# Altium schematic sheet 1_P1.schdoc
size 307 x 218 mm; Symbol: Drawing-Symbol_A4; Device: Drawing-Symbol_A4; Company: 嘉立创EDA; Version: V1.0; Page Size: A4; @Project Name: Analog_Buck; @Page Count: 1; @Update Date: 2025-11-11; @Create Date: 2025-11-09; @Schematic Name: Schematic1; @Page No: 1; @Page Name: P1; @Create Time: 08:32:45; @Update Time: 21:01:50; Width: 1170; Height: 825; Region Start: 1; X Region Count: 6; Y Region Count: 4; Blade Width: 10; Title Block Position: 3; @Board Name: Board1
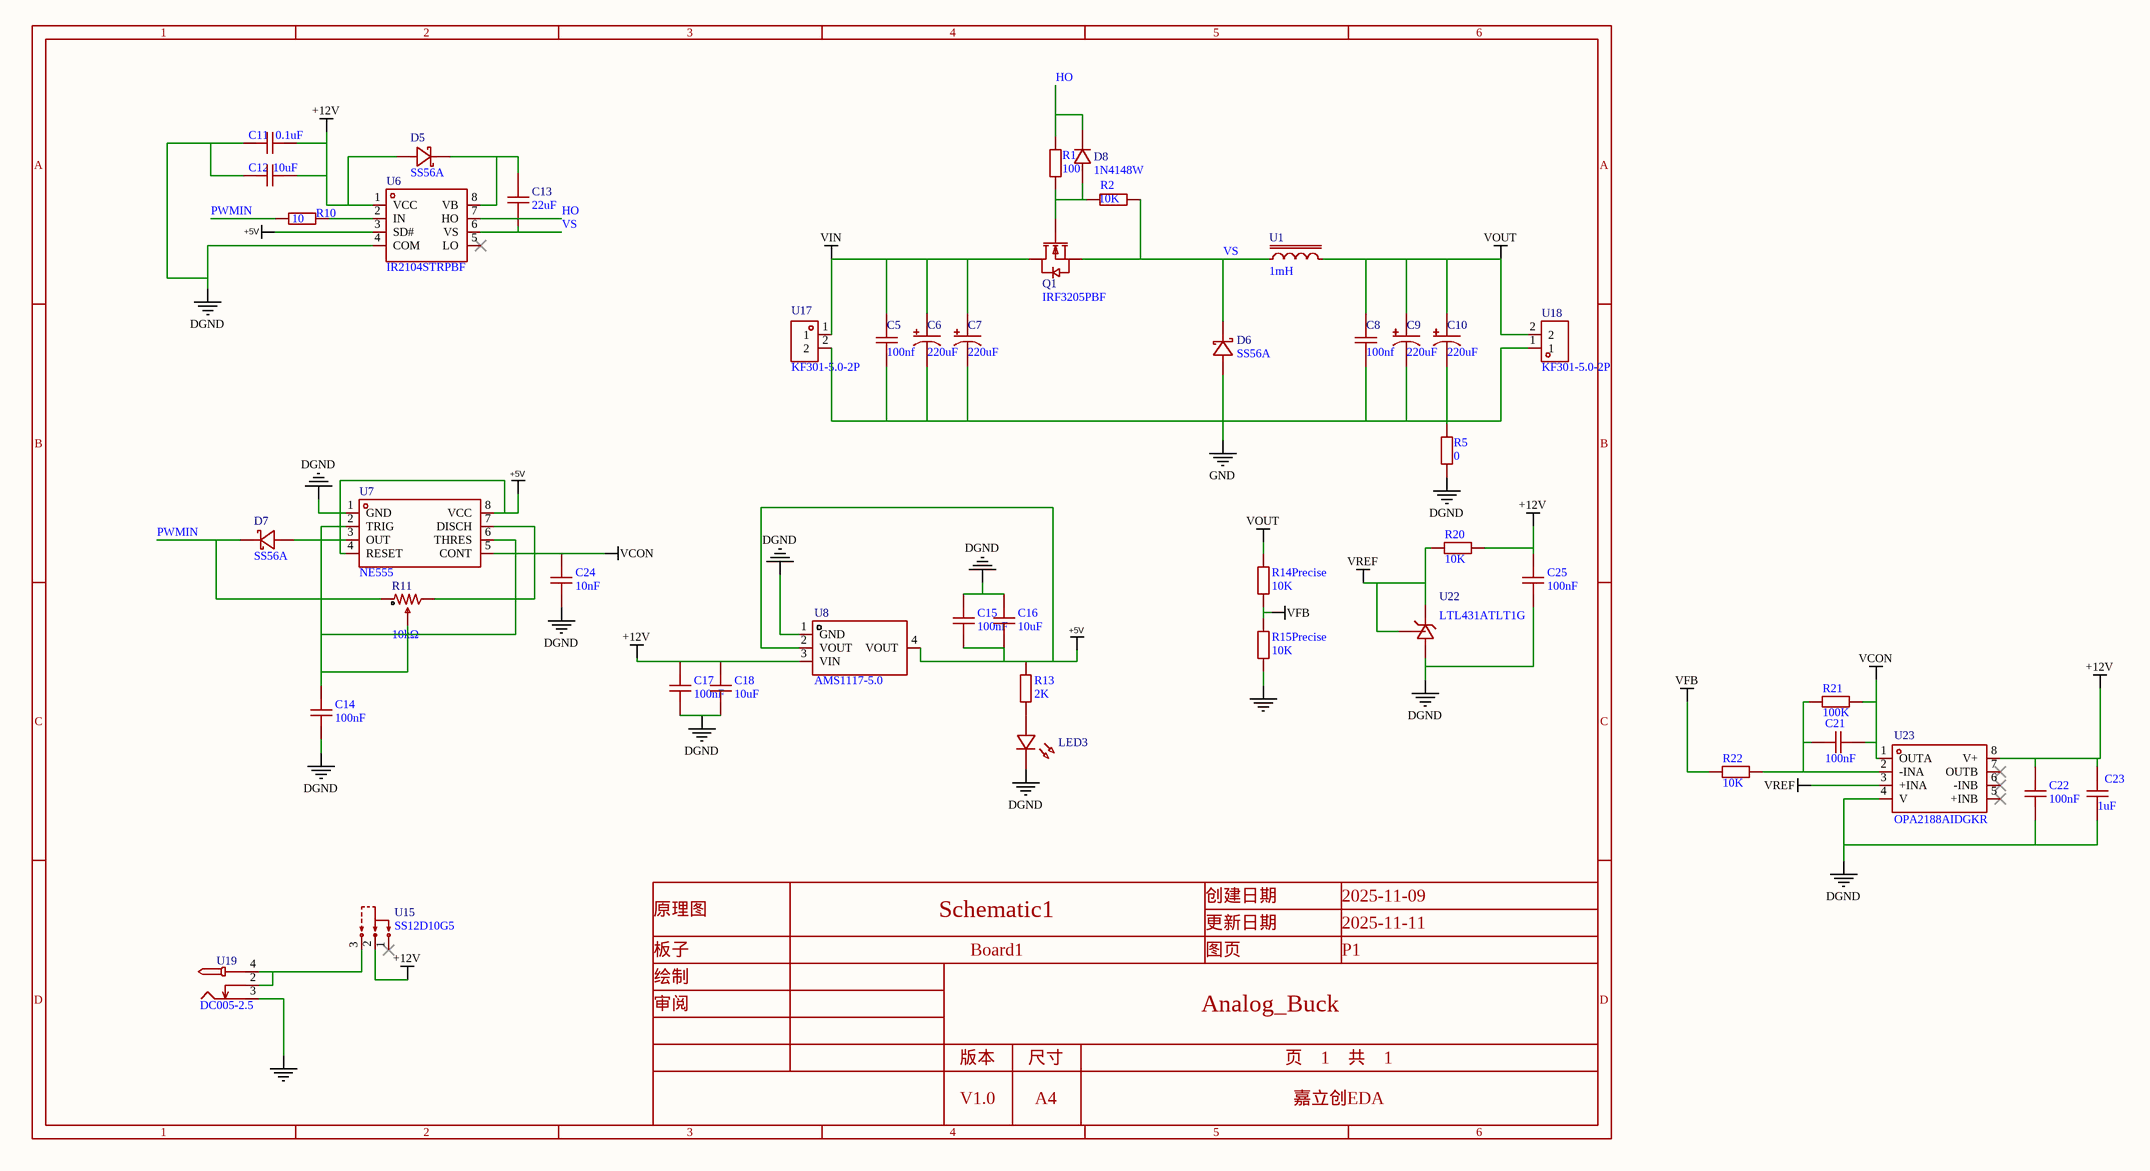
[diagram p0: 1_P1.schdoc]

## Parts
C5  100nf  [CAP-TH_L8.5-W5.0-P5.00-D1.2]
C6  220uF  [CAP-TH_BD10.0-P5.00-D0.6-FD]
C7  220uF  [CAP-TH_BD10.0-P5.00-D0.6-FD]
C8  100nf  [CAP-TH_L8.5-W5.0-P5.00-D1.2]
C9  220uF  [CAP-TH_BD10.0-P5.00-D0.6-FD]
C10  220uF  [CAP-TH_BD10.0-P5.00-D0.6-FD]
C11  0.1uF  [C0603]
C12  10uF  [C0603]
C13  22uF  [CAP-TH_L6.0-W3.8-P5.08-D0.6]
C14  100nF  [C0603]
C15  100nF  [C0603]
C16  10uF  [C0603]
C17  100nF  [C0603]
C18  10uF  [C0603]
C21  100nF  [C0603]
C22  100nF  [C0603]
C23  1uF  [C0603]
C24  10nF  [C0603]
C25  100nF  [C0603]
D5  SS56A  [SMA_L4.2-W2.6-LS5.0-RD]
D6  SS56A  [SMA_L4.2-W2.6-LS5.0-RD]
D7  SS56A  [SMA_L4.2-W2.6-LS5.0-RD]
D8  1N4148W  [SOD-123F_L2.7-W1.6-LS3.8-RD]
LED3  (no value)  [LED_0805]
Q1  IRF3205PBF  [TO-220-3_L10.0-W4.5-P2.54-L]
R1  100  [R0603]
R2  10K  [R0603]
R5  0  [R0603]
R10  10  [R0603]
R11  10kΩ  [RES-ADJ-TH_3P-L9.5-W4.9-P2.50-L_3296W]
R13  2K  [R0603]
R14Precise  10K  [R0603]
R15Precise  10K  [R0603]
R20  10K  [R0603]
R21  100K  [R0603]
R22  10K  [R0603]
U1  1mH  [IND-TH_L33.0-W15.6-P15.00-D1.5]
U6  IR2104STRPBF  [SOIC-8_L4.9-W3.9-P1.27-LS6.0-BL]
U7  NE555  [SOP-8_L5.0-W4.0-P1.27-LS6.0-BL]
U8  AMS1117-5.0  [SOT-223_L6.5-W3.5-P2.30-LS7.0-BR]
U15  SS12D10G5  [SW-TH_SHOU-HAN_SS12D10G4]
U17  KF301-5.0-2P  [CONN-TH_P5.00_KF301-5.0-2P]
U18  KF301-5.0-2P  [CONN-TH_P5.00_KF301-5.0-2P]
U19  DC005-2.5  [DC-IN-TH_DC005-2.5MM]
U22  LTL431ATLT1G  [SOT-23-3_L2.9-W1.3-P1.90-LS2.4-BR]
U23  OPA2188AIDGKR  [VSSOP-8_L3.0-W3.0-P0.65-LS4.9-BL]

## Nets
+5V: C15.1 C16.1 R13.2 U6.3(SD#) U7.4(RESET) U7.8(VCC) U8.2(VOUT) U8.4(VOUT)
+12V: C11.1 C12.1 C17.2 C18.2 C22.2 C23.2 C25.2 D5.2(A) R20.2 U6.1(VCC) U8.3(VIN) U15.2 U23.8(V+)
DGND: C11.2 C12.2 C14.1 C15.2 C16.2 C17.1 C18.1 C22.1 C23.1 C24.1 C25.1 LED3.1(C) R5.1 U6.4(COM) U7.1(GND) U8.1(GND) U19.3 U22.3(A) U23.4(V)
GND: C5.1 C6.2 C7.2 C8.1 C9.2 C10.2 D6.2(A) R5.2 R15Precise.1 U17.2 U18.1
VCON: C21.2 C24.2 R21.1 U7.5(CONT) U23.1(OUTA)
VFB: R14Precise.1 R15Precise.2 R22.1
VIN: C5.2 C6.1 C7.1 Q1.2(D) U17.1
VOUT: C8.2 C9.1 C10.1 R14Precise.2 U1.2 U18.2
VREF: R20.1 U22.1(C) U22.2(REF) U23.3(+INA)
HO: D8.1(K) R1.1 U6.7(HO)
PWMIN: D7.1(K) R10.1 R11.1
VS: C13.1 D6.1(K) Q1.3(S) R2.1 U1.1 U6.6(VS)
NetC13_2: C13.2 D5.1(K) U6.8(VB)
NetC14_2: C14.2 R11.2 U7.2(TRIG) U7.6(THRES)
NetC21_1: C21.1 R21.2 R22.2 U23.2(-INA)
NetD7_2: D7.2(A) U7.3(OUT)
NetD8_2: D8.2(A) Q1.1(G) R1.2 R2.2
NetLED3_2: LED3.2(A) R13.1
NetR10_2: R10.2 U6.2(IN)
NetR11_3: R11.3 U7.7(DISCH)
NetU15_3: U15.3 U19.2 U19.4

Not connected (* = marked no-connect by the designer): U6 5(LO)*; U15 1*; U23 5(+INB)* 6(-INB)* 7(OUTB)*

## Notes on the sheet
- 1
- 2
- 3
- 4
- 5
- 6
- A
- B
- C
- 原理图
- Schematic1
- 创建日期
- 更新日期
- 2025-11-09
- 2025-11-11
- 板子
- 绘制
- Board1
- 图页
- P1
- D
- 审阅
- 版本
- 尺寸
- Analog_Buck
- 页    1    共    1
- V1.0
- A4
- 嘉立创EDA

## Library data of the parts
C5 C8 = CT4-0805B104K500F3: Manufacturer: FH(风华); Add into BOM: yes; Tolerance: ±10%; Voltage Rated: 50V; Temperature Coefficient: X7R; Symbol: CT4-0805B104K500F3; Device: CT4-0805B104K500F3; LCSC Part Name: 100nF ±10% 50V C3型（直脚）; Manufacturer Part: CT4-0805B104K500F3; Supplier Footprint: 插件,P=5.08mm; JLCPCB Part Class: 扩展库; Datasheet: https://atta.szlcsc.com/upload/public/pdf/source/20190402/C385200_059806A6312B28FF1421A2413EB641E1.pdf; Supplier: LCSC; Convert to PCB: yes; Value: 100nf
C6 C7 C9 C10 = ECF1JM221G17OTPO: Manufacturer: Yunxing(云星); Symbol: LKME2502A221MF; Add into BOM: yes; Tolerance: ±20%; Voltage Rating: 63V; Lifetime: 6000hrs@105℃; Device: ECF1JM221G17OTPO; LCSC Part Name: 220uF ±20% 63V; Supplier Part: C783503; Manufacturer Part: ECF1JM221G17OTPO; Supplier Footprint: 插件,D10xL17mm; JLCPCB Part Class: Extended Part; Datasheet: https://item.szlcsc.com/datasheet/ECF1JM221G17OTPO/837828.html; Supplier: LCSC; Convert to PCB: yes; Value: 220uF; Ripple Current: -; Equivalent Series Resistance(ESR): -; Pin Spacing: -; Diameter: 10mm; Height - Seated (Max): 17mm; Operating Temperature: -40℃~+105℃
C11 C12 C14-C18 C21 C24 = CAP_0603: Symbol: Capacitance; Convert to PCB: yes; Device: CAP_0603; Add into BOM: yes; Supplier Footprint: 0603
  C11: Value: 0.1uF
  C12 C16 C18: Value: 10uF
  C14 C15 C17 C21: Value: 100nF
  C24: Value: 10nF
C13 = CD1H225KC9BER1F100: Manufacturer: Dersonic(德尔创); Symbol: CT40805B104K500F3; Add into BOM: yes; Tolerance: ±10%; Voltage Rating: 50V; Temperature Coefficient: X7R; Device: CD1H225KC9BER1F100; LCSC Part Name: 2.2uF ±10% 50V; Manufacturer Part: CD1H225KC9BER1F100; Supplier Footprint: 插件,P=5.08mm; JLCPCB Part Class: Extended Part; Datasheet: https://item.szlcsc.com/datasheet/CD1H225KC9BER1F100/3383616.html; Supplier: LCSC; Convert to PCB: yes; Value: 22uF
C22 C23 C25 = CAP_0603: Symbol: CapAcitance; Convert to PCB: yes; Device: CAP_0603; Add into BOM: yes; Supplier Footprint: 0603
  C22 C25: Value: 100nF
  C23: Value: 1uF
D5-D7 = SS56A: Manufacturer: FUXINSEMI(富芯森美); Add into BOM: yes; Diode Configuration: 独立式; Voltage - Forward(Vf@If): 700mV@5A; Voltage - DC Reverse(Vr): 60V; Current - Rectified: 5A; Reverse Leakage Current (Ir): 500nA; Operating Junction Temperature Range: -55℃~+150℃; Non-Repetitive Peak Forward Surge Current: 150A; Symbol: SS56A; Device: SS56A; LCSC Part Name: 电压:60V 电流:5A; Supplier Part: C842793; Manufacturer Part: SS56A; Supplier Footprint: SMA(DO-214AC); JLCPCB Part Class: 扩展库; Datasheet: https://item.szlcsc.com/datasheet/SS56A/901411.html; Supplier: LCSC; Convert to PCB: yes
D8 = 1N4148W_C81598: Manufacturer: ST(先科); Add into BOM: yes; Diode Configuration: 独立式; Voltage - Forward(Vf@If): 1V@50mA; Voltage - DC Reverse(Vr): 75V; Current - Rectified: 150mA; Pd - Power Dissipation: 400mW; Reverse Leakage Current (Ir): 1uA@75V; Reverse Recovery Time (trr): 4ns; Non-Repetitive Peak Forward Surge Current: 1A; Symbol: 1N4148W_C81598; Device: 1N4148W_C81598; LCSC Part Name: 1N4148W; Supplier Part: C81598; Manufacturer Part: 1N4148W; Supplier Footprint: SOD-123; JLCPCB Part Class: 基础库; Datasheet: https://item.szlcsc.com/datasheet/1N4148W/82750.html; Supplier: LCSC; Convert to PCB: yes; Operating Junction Temperature Range: -
LED3 = LED_0805-G: Symbol: LED_G; Convert to PCB: yes; Device: LED_0805-G; Add into BOM: yes; Supplier Footprint: 0805
Q1 = IRF3205PBF: Manufacturer: Infineon(英飞凌); Add into BOM: yes; Type: 1个N沟道; Drain Source Voltage (Vdss): 55V; Continuous Drain Current (Id): 110A; Drain Source On Resistance (RDS(on)@Vgs,Id): 8mΩ@10V,62A; Power Dissipation (Pd): 200W; Gate Threshold Voltage (Vgs(th)@Id): 4V@250uA; Total Gate Charge (Qg@Vgs): 146nC; Input Capacitance (Ciss@Vds): 3.247nF; Reverse Transfer Capacitance (Crss@Vds): 211pF; Symbol: IRF3205PBF; Device: IRF3205PBF; LCSC Part Name: 1个N沟道 耐压:55V 电流:110A; Supplier Part: C2561; Manufacturer Part: IRF3205PBF; Supplier Footprint: TO-220AB; JLCPCB Part Class: 扩展库; Datasheet: https://atta.szlcsc.com/upload/public/pdf/source/20201126/C2561_C063ADD03C5ACFC796E423BE08ECDD89.pdf; Supplier: LCSC; Convert to PCB: yes; Operating Temperature: -55℃~+175℃
R1 R2 R5 R10 R13 R14Precise R15Precise R20-R22 = Res_0603: Symbol: 电阻; Convert to PCB: yes; Device: Res_0603; Add into BOM: yes; Supplier Footprint: 0603
  R1: Value: 100
  R2 R14Precise R15Precise R20 R22: Value: 10K
  R5: Value: 0
  R10: Value: 10
  R13: Value: 2K
  R21: Value: 100K
R11 = 3296W-1-103LF_C49190453: Manufacturer: JIERR(捷而瑞); Add into BOM: yes; Tolerance: ±10%; Power(Watts): 500mW; Temperature Coefficient: ±250ppm/℃; Number of Turns: 28; Symbol: 3296W-1-103LF_C49190453; Device: 3296W-1-103LF_C49190453; LCSC Part Name: 3296W-1-103LF; Supplier Part: C49190453; Manufacturer Part: 3296W-1-103LF; Supplier Footprint: 插件-3P,9.5x4.9mm; JLCPCB Part Class: 扩展库; Datasheet: https://item.szlcsc.com/datasheet/3296W-1-103LF/51587046.html; Supplier: LCSC; Convert to PCB: yes; Value: 10kΩ
U1 = XR106125TS470MV1L5: Manufacturer: XR(祥如); Add into BOM: yes; Tolerance: ±10%; Rated Current: 12A; Wire Diameter: 1.5mm; Symbol: XR106125TS470MV1L5; Device: XR106125TS470MV1L5; LCSC Part Name: 47uH ±10% 磁环电感; Manufacturer Part: XR106125TS470MV1L5; Supplier Footprint: 插件,33x15.6mm; JLCPCB Part Class: 扩展库; Datasheet: https://atta.szlcsc.com/upload/public/pdf/source/20240313/975BD6823DE6C304357683F4CE864895.pdf; Supplier: LCSC; Convert to PCB: yes; Value: 1mH; Type: 磁环电感
U6 = IR2104STRPBF: Manufacturer: Infineon(英飞凌); Add into BOM: yes; Driven Configuration: 半桥; Load Type: IGBT；MOSFET; Number of Drivers: 2; Current - Output Low(IOL): 270mA; Current - Output High(IOH): 130mA; Voltage - Supply: 10V~20V; Rise Time: 100ns; Fall Time: 50ns; Propagation Delay tpLH: 680ns; Propagation Delay tpHL: 150ns; Quiescent Current(Iq): 150uA; Symbol: IR2104STRPBF; Device: IR2104STRPBF; LCSC Part Name: 半桥驱动器; Supplier Part: C2960; Manufacturer Part: IR2104STRPBF; Supplier Footprint: SOIC-8; JLCPCB Part Class: 扩展库; Datasheet: https://item.szlcsc.com/datasheet/IR2104STRPBF/3342.html; Supplier: LCSC; Convert to PCB: yes; Features: 欠压保护(UVP); Operating Temperature: -40℃~+150℃@(Tj)
U7 = NE555: Add into BOM: yes; Symbol: NE555; Device: NE555; LCSC Part Name: NE555; Supplier Part: C504549; Manufacturer Part: NE555; Supplier Footprint: SOP-8-4.0mm; JLCPCB Part Class: 扩展库; Supplier: LCSC; Convert to PCB: yes
U8 = AMS1117-5.0_C6187: Manufacturer: AMS; Add into BOM: yes; Output Type: 固定; Voltage - Supply: 15V; Output Voltage: 5V; Output Current: 1A; Power Supply Rejection Ratio (PSRR): 60dB; Voltage Dropout: 1.3V; Output Configuration: 正极; Number of Outputs: 1; Symbol: AMS1117-5.0; Device: AMS1117-5.0_C6187; LCSC Part Name: 输入15V 输出5V 1A; Supplier Part: C6187; Manufacturer Part: AMS1117-5.0; Supplier Footprint: SOT-223; JLCPCB Part Class: 基础库; Datasheet: https://item.szlcsc.com/datasheet/AMS1117-5.0/6653.html; Supplier: LCSC; Convert to PCB: yes; standby current: -; Noise: -; Features: -; Operating Temperature: -40℃~+125℃
U15 = SS12D10G5: Manufacturer: SHOU HAN(首韩); Add into BOM: yes; Circuit: 单刀双掷; Current Rating: 2A; Voltage Rating: 125V; Life: 3千次; Symbol: SS12D10G5; Device: SS12D10G5; LCSC Part Name: 两档立式插件 3脚拨动开关 柄长5.0mm; Supplier Part: C7431054; Manufacturer Part: SS12D10G5; Supplier Footprint: 插件,12.7x6.7mm; JLCPCB Part Class: 扩展库; Datasheet: https://item.szlcsc.com/datasheet/SS12D10G5/8431406.html; Supplier: LCSC; Convert to PCB: yes; Length: 12.7mm; Width: 6.7mm; Mounting Type: 直插; Operating Temperature: -25℃~+70℃
U17 U18 = KF301-5.0-2P: Manufacturer: KEFA(科发); Add into BOM: yes; Structure: 1x2P; Pitch: 5mm; Current Rating (Max): 17A; Voltage Rating (Max): 250V; Wire Gauge - AWG: 14~22; Wire Gauge - mm2: 1.5; Number of PINs Per Row: 2; Symbol: KF301-5.0-2P; Device: KF301-5.0-2P; LCSC Part Name: 5mm 1x2P 排数:1 每排P数:2 直插; Supplier Part: C474881; Manufacturer Part: KF301-5.0-2P; Supplier Footprint: 插件,P=5mm; JLCPCB Part Class: 扩展库; Datasheet: https://atta.szlcsc.com/upload/public/pdf/source/20230317/03A5B5FC229D6F9225E8F51DA1A4E80A.pdf; Supplier: LCSC; Convert to PCB: yes; Color: 蓝色; Mounting Style: 直插; Number of Pins: 2P; Number of Rows: 1; Operating Temperature Range: -30℃~+120℃
U19 = DC005-2.5: Manufacturer: SHOU HAN(首韩); Add into BOM: yes; Connector Type: DC电源插座; Inside Contact Diameter: 2.5mm; Outside Contact Diameter: 6.3mm; Current Rating: 500mA; Voltage Rating (Max): 30V; Symbol: DC005-2.5; Device: DC005-2.5; LCSC Part Name: DC电源插座 内径:2.5mm 外径:6.3mm; Supplier Part: C7507454; Manufacturer Part: DC005-2.5; Supplier Footprint: 插件; JLCPCB Part Class: 扩展库; Datasheet: https://item.szlcsc.com/datasheet/DC005-2.5/8598476.html; Supplier: LCSC; Convert to PCB: yes; Mounting Type: 弯插; Operating Temperature: -25℃~+70℃
U22 = LTL431ATLT1G: Manufacturer: LRC(乐山无线电); Add into BOM: yes; Output Type: 可编程; Output Voltage: 2.5V~36V; Output Current: 100mA; Minimum Cathode Current for Regulation: 1mA; Symbol: LTL431ATLT1G; Device: LTL431ATLT1G; LCSC Part Name: 2.5V~36V 100mA; Supplier Part: C83052; Manufacturer Part: LTL431ATLT1G; Supplier Footprint: SOT-23(SOT-23-3); JLCPCB Part Class: Extended Part; Datasheet: https://atta.szlcsc.com/upload/public/pdf/source/20161024/1477288490977.pdf; Supplier: LCSC; Convert to PCB: yes; Operating Temperature: -40℃~+125℃@(TA)
U23 = OPA2188AIDGKR: Manufacturer: TI(德州仪器); Add into BOM: yes; Number of Channels: 双路; Gain Bandwidth Product: 2MHz; Ib - Input Bias Current: 160pA; Vos - Input Offset Voltage: 6uV; Slew Rate: 0.8V/us; Symbol: OPA2188AIDGKR; Device: OPA2188AIDGKR; LCSC Part Name: OPA2188AIDGKR; Supplier Part: C2865632; Manufacturer Part: OPA2188AIDGKR; Supplier Footprint: VSSOP-8; JLCPCB Part Class: 扩展库; Datasheet: https://www.ti.com/cn/lit/gpn/opa2188; Supplier: LCSC; Convert to PCB: yes; Rail to Rail: -; Operating Temperature: -40℃~+105℃